# EAGLE design lp2951-breakout (EAGLE 5.06)
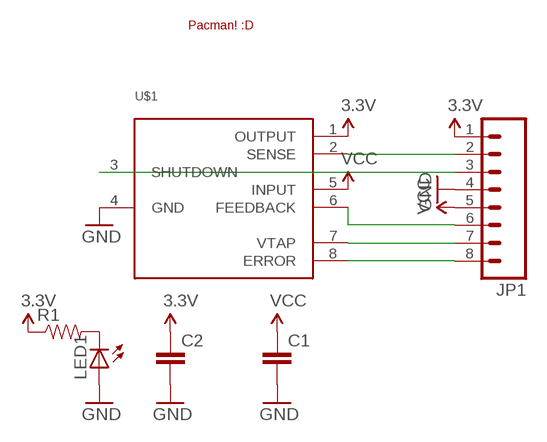
[diagram p0: schematic, sheet 1]

## Parts
C1  CAP0603-CAP  [0603-CAP]
C2  CAP0603-CAP  [0603-CAP]
JP1  M08LOCK  [1X08_LOCK]
LED1  LED0603  [LED-0603]
R1  RESISTOR0603-RES  [0603-RES]
U$1  LP2951ACM-3.3  [SOIC-8]
U$2  PAC  [PAC]

## Nets
3.3V: C2.1 JP1.1 R1.1 U$1.1(OUTPUT)
GND: C1.2 C2.2 JP1.4 LED1.A U$1.4(GND)
N$1: JP1.2 U$1.2(SENSE)
N$2: JP1.3 U$1.3(SHUTDOWN)
N$3: JP1.6 U$1.6(FEEDBACK)
N$4: JP1.7 U$1.7(VTAP)
N$5: JP1.8 U$1.8(ERROR)
N$6: LED1.C R1.2
VCC: C1.1 JP1.5 U$1.5(INPUT)

## Library data of the parts
C1 C2 = SparkFun:CAP: Capacitor Standard 0603 ceramic capacitor, and 0.1" leaded capacitor.
JP1 = SparkFun:M08: Header 8 Standard 8-pin 0.1" header. Use with straight break away headers (SKU : PRT-00116), right angle break away headers (PRT-00553), swiss pins (PRT-00743), machine pins (PRT-00117), and female headers (PRT-00115).
LED1 = SparkFun:LED: LEDs Standard schematic elements and footprints for 5mm, 3mm, 1206, and 0603 sized LEDs. 5mm - Spark Fun Electronics SKU : COM-00529 (and others)
R1 = SparkFun:RESISTOR: Resistor Basic schematic elements and footprints for 0603, 1206, and PTH 1/10th watt (small) resistors.
U$1 = joshashby:LP2951ACM-3.3: LP2951 3.3V 100mA low drop out, accurate (.5% tolerance) regulator from National Semi in the SOIC-8 package with the Sense, Feedback, Error, Shutdown and V-Tap pins broken out.
U$2 = joshashby:PAC: Pacman! :D

## Board
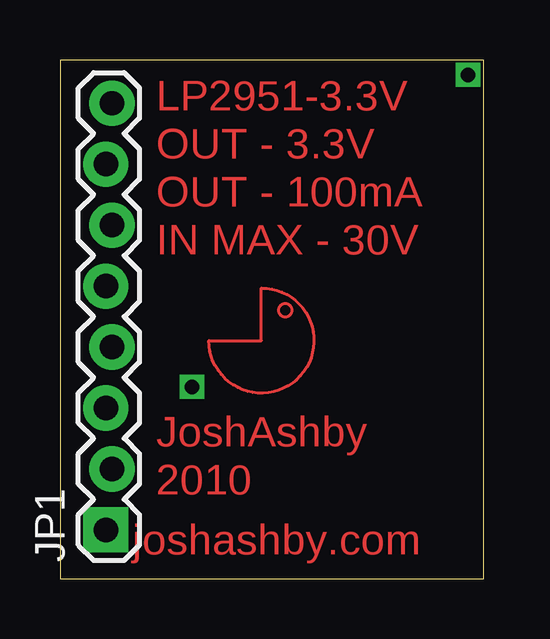
[diagram p1: board, top side]
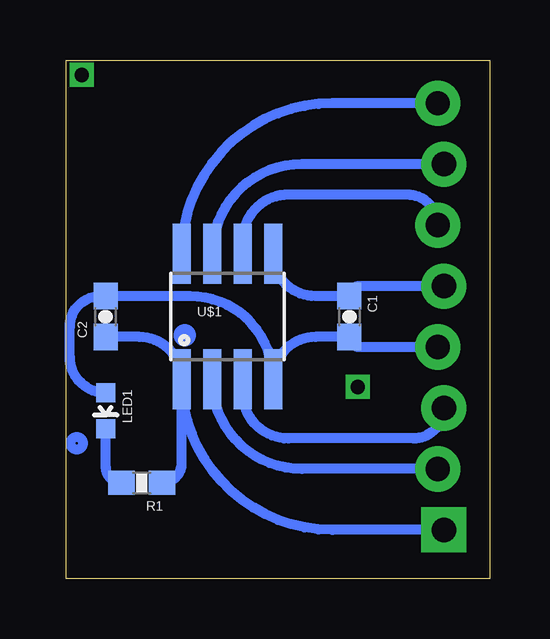
[diagram p2: board, bottom side, seen from below]

Size 17.65 x 21.62 mm. Coordinates in mm from the lower left corner, seen from the top.
Outline: 0,0 17.65,0 17.65,21.62 0,21.62 0,0
Copper layers (1*16): Top 0.035mm / dielectric 1.5mm / Bottom 0.035mm
Design rules "default": minimum track width 10mil, minimum drill 24mil, track to track 8mil, track to pad 8mil, pad to pad 8mil, via to via 8mil, smd to smd 8mil, copper to edge 40mil, drill to drill 8mil, minimum pad ring 10mil, minimum via ring 8mil, stop-mask expansion 4mil, vias tented up to drill 0mil, thermal gap 10mil

### Footprints (pad centres in the part's own frame; a part is rotated, then mirrored left to right if it is on the bottom)
0603-CAP = smd 1.1 x 1: 1 -0.85,0; 2 0.85,0
1X08_LOCK = drill 1.016 pad 1.88 square: 1 0,0.127 | drill 1.016 pad 1.88 round: 2 2.54,-0.127; 3 5.08,0.127; 4 7.62,-0.127; 5 10.16,0.127; 6 12.7,-0.127; 7 15.24,0.127; 8 17.78,-0.127
LED-0603 = smd 0.8 x 0.8: A 0,-0.75; C 0,0.75
0603-RES = smd 1.1 x 1: 1 -0.85,0; 2 0.85,0
SOIC-8 = smd 0.75 x 2.5: 1 -1.905,-2.616; 2 -0.635,-2.616; 3 0.635,-2.616; 4 1.905,-2.616; 5 1.905,2.616; 6 0.635,2.616; 7 -0.635,2.616; 8 -1.905,2.616

### Placement (x,y rotation side)
C1  5.85,10.93 270 bottom
C2  16.01,10.93 90 bottom
JP1  2.04,2.04 90 top
LED1  16,7 180 bottom
R1  14.5,4 180 bottom
U$1  10.93,10.93 0 bottom
U$2  8.39,9.93 0 top

### Tracks (layer width: path | path; a pad name or v marks a point on that pad's centre or on a via)
3.3V
  Bottom 0.406: JP1.1 6.56,2.04 arc90 U$1.1 | U$1.1 arc-90 14.6,10.08 C2.1 | R1.1 arc-90 12.84,4.82 U$1.1
GND
  Bottom 0.406: JP1.4 5.43,9.66 arc90 C1.2 7.26,10.08 arc-90 U$1.4 arc-90 12.49,11.78 C2.2 16.22,11.78 arc-90 17.5,10.5 17.5,9.25 arc-90 LED1.A
N$1
  Bottom 0.406: JP1.2 7.83,4.58 arc90 U$1.2
N$2
  Bottom 0.406: JP1.3 arc90 3.18,5.85 8.39,5.85 arc90 10.29,7.75 U$1.3
N$3
  Bottom 0.406: U$1.6 10.29,14.11 arc90 8.39,16.01 3.44,16.01 arc90 JP1.6
N$4
  Bottom 0.406: JP1.7 7.83,17.28 arc-90 U$1.7
N$5
  Bottom 0.406: JP1.8 6.56,19.82 arc-90 U$1.8
N$6
  Bottom 0.406: R1.2 arc90 16,4.65 LED1.C
N$7  (via drill 0.6)
  other vias: 17,21
N$8  (via drill 0.6)
  other vias: 5.5,8
VCC
  Bottom 0.406: JP1.5 5.43,12.2 arc-90 C1.1 7.26,11.78 arc90 U$1.5
(copper drawn outside any net)
  shapes: Bottom circle x2

### Text on the board
Top: LP2951-3.3V | OUT - 3.3V | OUT - 100mA | IN MAX - 30V | JoshAshby | 2010 | joshashby.com